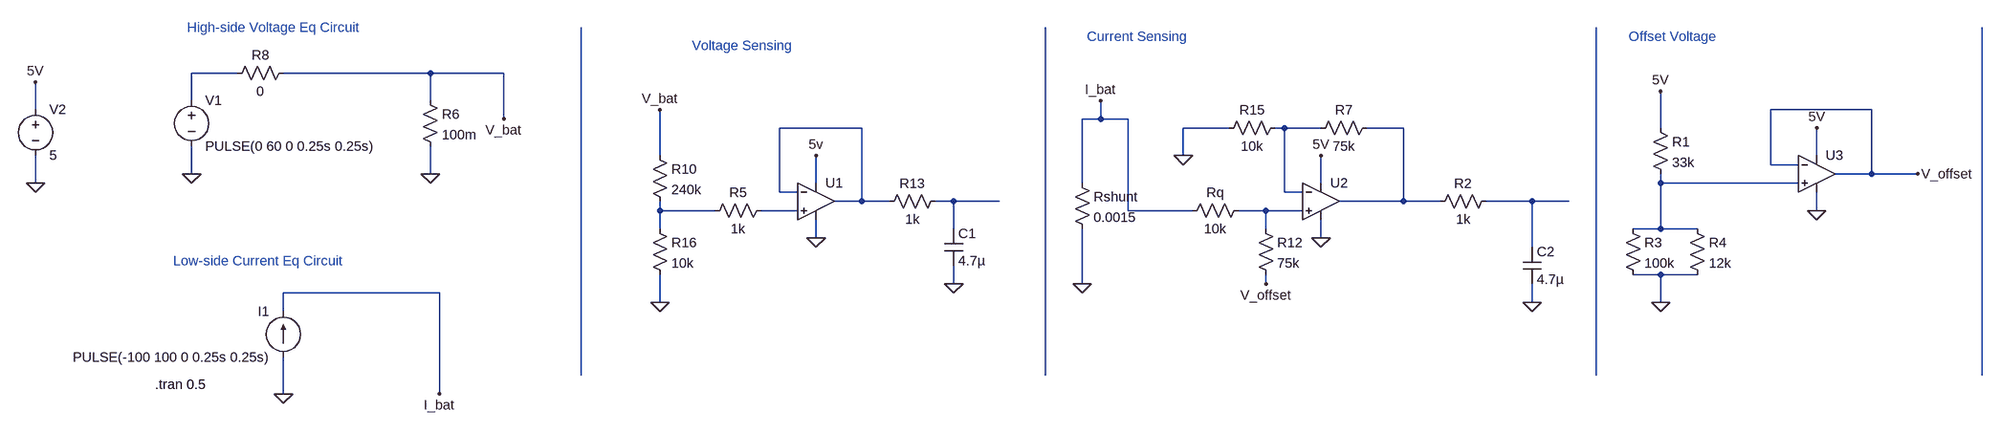
[diagram p0: schematic CurrentVoltageSense.asc]
CurrentVoltageSense.asc, the LTspice schematic file:
Version 4
SHEET 1 2388 680
WIRE -688 -80 -768 -80
WIRE -352 -80 -608 -80
WIRE -224 -80 -352 -80
WIRE -768 -32 -768 -80
WIRE -352 -32 -352 -80
WIRE -1040 -16 -1040 -64
WIRE 2192 -16 2016 -16
WIRE -224 0 -224 -80
WIRE 848 0 848 -32
WIRE 848 0 816 0
WIRE 896 0 848 0
WIRE 432 16 288 16
WIRE 1072 16 992 16
WIRE 1168 16 1152 16
WIRE 1232 16 1168 16
WIRE 1376 16 1312 16
WIRE 1824 16 1824 -48
WIRE 80 64 80 -16
WIRE 992 64 992 16
WIRE 2096 64 2096 16
WIRE 2016 80 2016 -16
WIRE 2064 80 2016 80
WIRE -768 96 -768 48
WIRE -352 96 -352 48
WIRE 2192 96 2192 -16
WIRE 2192 96 2128 96
WIRE 2272 96 2192 96
WIRE -1040 112 -1040 64
WIRE 352 112 352 64
WIRE 816 112 816 0
WIRE 1232 112 1232 64
WIRE 1824 112 1824 96
WIRE 2064 112 1824 112
WIRE 288 128 288 16
WIRE 320 128 288 128
WIRE 1168 128 1168 16
WIRE 1200 128 1168 128
WIRE 432 144 432 16
WIRE 432 144 384 144
WIRE 480 144 432 144
WIRE 592 144 560 144
WIRE 672 144 592 144
WIRE 1376 144 1376 16
WIRE 1376 144 1264 144
WIRE 1440 144 1376 144
WIRE 1600 144 1520 144
WIRE 1664 144 1600 144
WIRE 80 160 80 144
WIRE 176 160 80 160
WIRE 320 160 256 160
WIRE 896 160 896 0
WIRE 1008 160 896 160
WIRE 1136 160 1088 160
WIRE 1200 160 1136 160
WIRE 2096 160 2096 128
WIRE 80 192 80 160
WIRE 592 192 592 144
WIRE 1136 192 1136 160
WIRE 1824 192 1824 112
WIRE 1824 192 1776 192
WIRE 1888 192 1824 192
WIRE 352 208 352 176
WIRE 1232 208 1232 176
WIRE 1600 224 1600 144
WIRE 1824 272 1776 272
WIRE 1888 272 1824 272
WIRE 592 288 592 256
WIRE 816 288 816 192
WIRE 1136 288 1136 272
WIRE -336 304 -608 304
WIRE 80 320 80 272
WIRE 1600 320 1600 288
WIRE 1824 320 1824 272
WIRE -608 336 -608 304
WIRE -64 448 -64 -160
WIRE 752 448 752 -160
WIRE 1712 448 1712 -160
WIRE 2384 448 2384 -160
WIRE -608 480 -608 416
WIRE -336 480 -336 304
FLAG 80 320 0
FLAG 592 288 0
FLAG 352 208 0
FLAG 992 64 0
FLAG 816 288 0
FLAG 1600 320 0
FLAG 2096 160 0
FLAG 1824 320 0
FLAG -768 96 0
FLAG -352 96 0
FLAG -224 0 V_bat
FLAG 80 -16 V_bat
FLAG -1040 -64 5V
FLAG -1040 112 0
FLAG -608 480 0
FLAG -336 480 I_bat
FLAG 848 -32 I_bat
FLAG 352 64 5v
FLAG 1232 64 5V
FLAG 2096 16 5V
FLAG 1824 -48 5V
FLAG 2272 96 V_offset
FLAG 1136 288 V_offset
FLAG 1232 208 0
SYMBOL res 64 48 R0
SYMATTR InstName R10
SYMATTR Value 240k
SYMBOL res 64 176 R0
SYMATTR InstName R16
SYMATTR Value 10k
SYMBOL UniversalOpAmp 352 144 R0
SYMATTR InstName U1
SYMBOL res 576 128 R90
WINDOW 0 0 56 VBottom 2
WINDOW 3 32 56 VTop 2
SYMATTR InstName R13
SYMATTR Value 1k
SYMBOL cap 576 192 R0
SYMATTR InstName C1
SYMATTR Value 4.7µ
SYMBOL UniversalOpAmp 1232 144 R0
SYMATTR InstName U2
SYMBOL res 1328 0 R90
WINDOW 0 0 56 VBottom 2
WINDOW 3 32 56 VTop 2
SYMATTR InstName R7
SYMATTR Value 75k
SYMBOL res 1168 0 R90
WINDOW 0 0 56 VBottom 2
WINDOW 3 32 56 VTop 2
SYMATTR InstName R15
SYMATTR Value 10k
SYMBOL res 1120 176 R0
SYMATTR InstName R12
SYMATTR Value 75k
SYMBOL res 1104 144 R90
WINDOW 0 0 56 VBottom 2
WINDOW 3 32 56 VTop 2
SYMATTR InstName Rq
SYMATTR Value 10k
SYMBOL res 800 96 R0
SYMATTR InstName Rshunt
SYMATTR Value 0.0015
SYMBOL res 1536 128 R90
WINDOW 0 0 56 VBottom 2
WINDOW 3 32 56 VTop 2
SYMATTR InstName R2
SYMATTR Value 1k
SYMBOL cap 1584 224 R0
SYMATTR InstName C2
SYMATTR Value 4.7µ
SYMBOL res 1808 0 R0
SYMATTR InstName R1
SYMATTR Value 33k
SYMBOL UniversalOpAmp 2096 96 R0
SYMATTR InstName U3
SYMBOL res 1760 176 R0
SYMATTR InstName R3
SYMATTR Value 100k
SYMBOL res 1872 176 R0
SYMATTR InstName R4
SYMATTR Value 12k
SYMBOL voltage -768 -48 R0
WINDOW 123 0 0 Left 0
WINDOW 39 0 0 Left 0
SYMATTR InstName V1
SYMATTR Value PULSE(0 60 0 0.25s 0.25s)
SYMBOL current -608 416 R180
WINDOW 0 24 80 Left 2
WINDOW 3 24 0 Left 2
WINDOW 123 0 0 Left 0
WINDOW 39 0 0 Left 0
SYMATTR InstName I1
SYMATTR Value PULSE(-100 100 0 0.25s 0.25s)
SYMBOL voltage -1040 -32 R0
WINDOW 123 0 0 Left 0
WINDOW 39 0 0 Left 0
SYMATTR InstName V2
SYMATTR Value 5
SYMBOL res 272 144 R90
WINDOW 0 0 56 VBottom 2
WINDOW 3 32 56 VTop 2
SYMATTR InstName R5
SYMATTR Value 1k
SYMBOL res -368 -48 R0
SYMATTR InstName R6
SYMATTR Value 100m
SYMBOL res -592 -96 R90
WINDOW 0 0 56 VBottom 2
WINDOW 3 32 56 VTop 2
SYMATTR InstName R8
SYMATTR Value 0
TEXT 136 -128 Left 2 ;Voltage Sensing
TEXT 824 -144 Left 2 ;Current Sensing
TEXT 1768 -144 Left 2 ;Offset Voltage
TEXT -832 464 Left 2 !.tran 0.5
TEXT -776 -160 Left 2 ;High-side Voltage Eq Circuit
TEXT -800 248 Left 2 ;Low-side Current Eq Circuit

The netlist it stands for:
* CurrentVoltageSense.asc
R10 V_bat N008 240k
R16 N008 0 10k
XU1 N009 N002 5V 0 N002 level1 Avol=1Meg GBW=10Meg Vos=0 En=0 Enk=0 In=0 Ink=0 Rin=500Meg  ; pins In+ In- V+ V- OUT
R13 N006 N002 1k
C1 N006 0 4.7µ
XU2 N010 N003 5V 0 N004 level1 Avol=1Meg GBW=10Meg Vos=0 En=0 Enk=0 In=0 Ink=0 Rin=500Meg  ; pins In+ In- V+ V- OUT
R7 N004 N003 75k
R15 N003 0 10k
R12 N010 V_offset 75k
Rq N010 I_bat 10k
Rshunt I_bat 0 0.0015
R2 N007 N004 1k
C2 N007 0 4.7µ
R1 5V N005 33k
XU3 N005 V_offset 5V 0 V_offset level1 Avol=1Meg GBW=10Meg Vos=0 En=0 Enk=0 In=0 Ink=0 Rin=500Meg  ; pins In+ In- V+ V- OUT
R3 N005 0 100k
R4 N005 0 12k
V1 N001 0 PULSE(0 60 0 0.25s 0.25s)
I1 0 I_bat PULSE(-100 100 0 0.25s 0.25s)
V2 5V 0 5
R5 N009 N008 1k
R6 V_bat 0 100m
R8 V_bat N001 0
* Voltage Sensing
* Current Sensing
* Offset Voltage
.tran 0.5
* High-side Voltage Eq Circuit
* Low-side Current Eq Circuit
.lib UniversalOpAmp1.lib
.backanno
.end